# Altium schematic sheet APP_1_Power.SchDoc
size Tabloid; SheetNumber: 11; SheetTotal: 13; Sheet_Name: Power; Size: 11x17
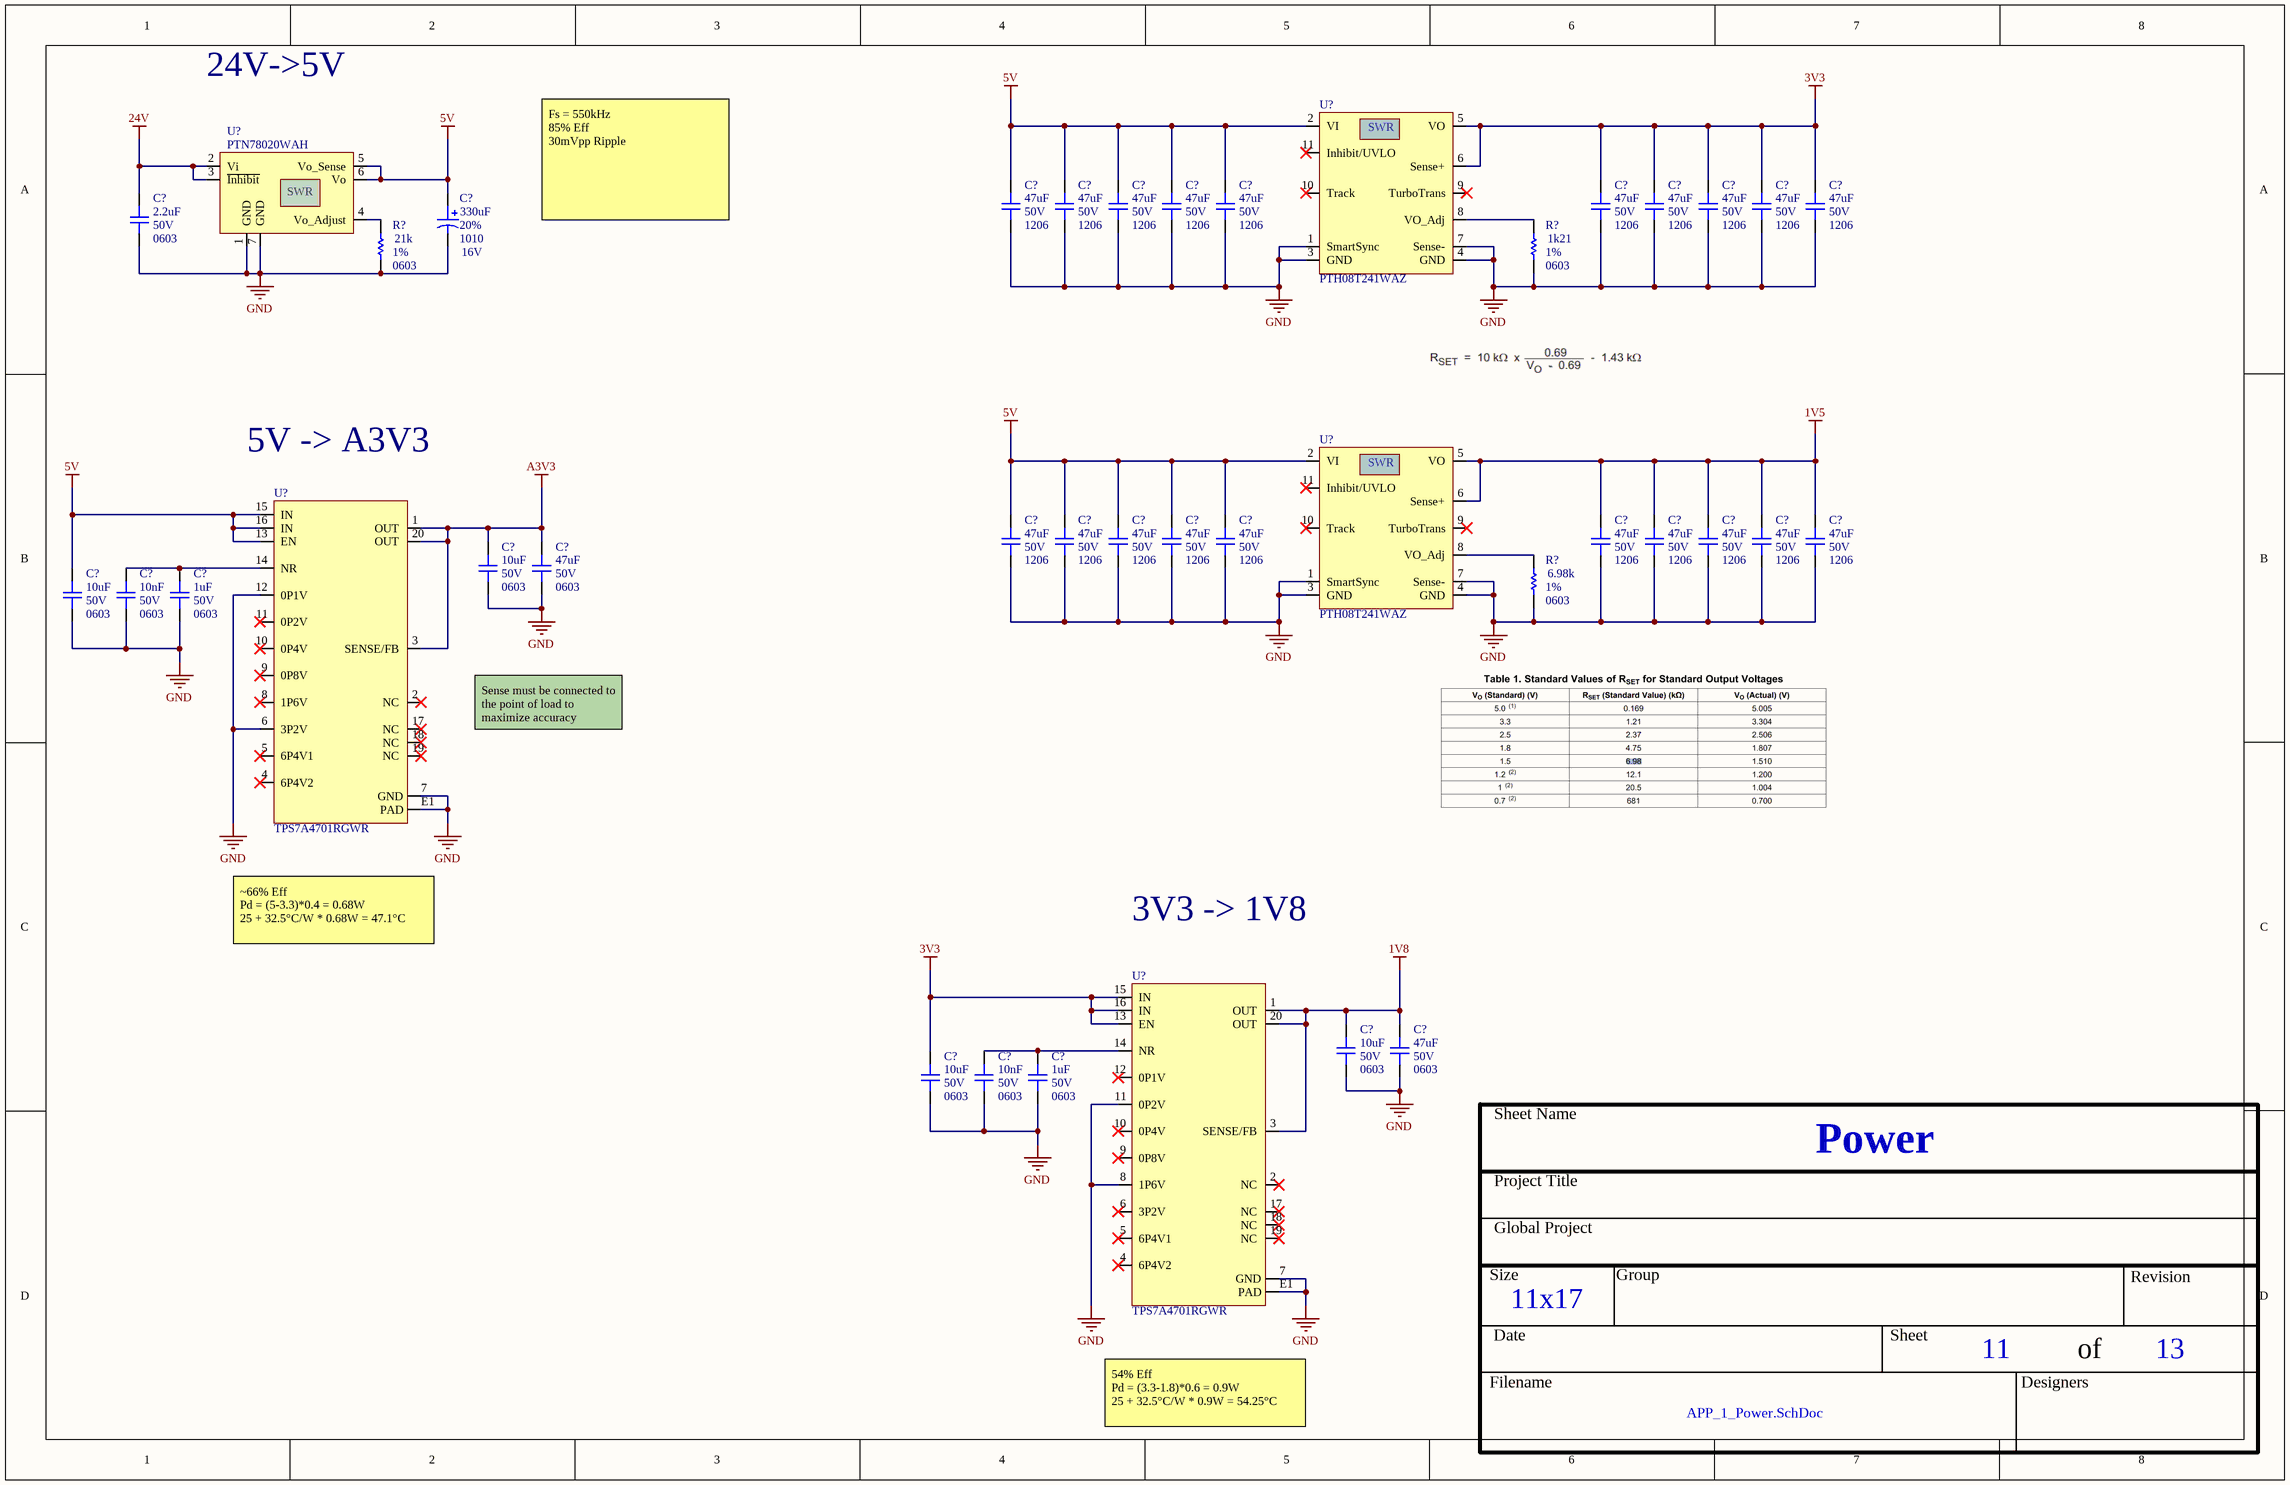
[diagram p0: APP_1_Power.SchDoc]

## Parts
(Parts that share a designator on the sheet are numbered #1, #2 ... from top to bottom, then left to right.)
C?#1  value 47uF  Voltage: 50V  Package: 1206  [CAP_1206]  (hidden comment: CAP - 1206)
C?#2  value 47uF  Voltage: 50V  Package: 1206  [CAP_1206]  (hidden comment: CAP - 1206)
C?#3  value 47uF  Voltage: 50V  Package: 1206  [CAP_1206]  (hidden comment: CAP - 1206)
C?#4  value 47uF  Voltage: 50V  Package: 1206  [CAP_1206]  (hidden comment: CAP - 1206)
C?#5  value 47uF  Voltage: 50V  Package: 1206  [CAP_1206]  (hidden comment: CAP - 1206)
C?#6  value 47uF  Voltage: 50V  Package: 1206  [CAP_1206]  (hidden comment: CAP - 1206)
C?#7  value 47uF  Voltage: 50V  Package: 1206  [CAP_1206]  (hidden comment: CAP - 1206)
C?#8  value 47uF  Voltage: 50V  Package: 1206  [CAP_1206]  (hidden comment: CAP - 1206)
C?#9  value 47uF  Voltage: 50V  Package: 1206  [CAP_1206]  (hidden comment: CAP - 1206)
C?#10  value 47uF  Voltage: 50V  Package: 1206  [CAP_1206]  (hidden comment: CAP - 1206)
C?#11  value 2.2uF  Voltage: 50V  Package: 0603  [CAP_0603]  (hidden comment: CAP - 0603)
C?#12  value 330uF  Voltage: 16V  Package: 1010  Precision: 20%  [CAP_ALU_1010_vishay]  (hidden comment: MAL214699501E3)
C?#13  value 47uF  Voltage: 50V  Package: 1206  [CAP_1206]  (hidden comment: CAP - 1206)
C?#14  value 47uF  Voltage: 50V  Package: 1206  [CAP_1206]  (hidden comment: CAP - 1206)
C?#15  value 47uF  Voltage: 50V  Package: 1206  [CAP_1206]  (hidden comment: CAP - 1206)
C?#16  value 47uF  Voltage: 50V  Package: 1206  [CAP_1206]  (hidden comment: CAP - 1206)
C?#17  value 47uF  Voltage: 50V  Package: 1206  [CAP_1206]  (hidden comment: CAP - 1206)
C?#18  value 47uF  Voltage: 50V  Package: 1206  [CAP_1206]  (hidden comment: CAP - 1206)
C?#19  value 47uF  Voltage: 50V  Package: 1206  [CAP_1206]  (hidden comment: CAP - 1206)
C?#20  value 47uF  Voltage: 50V  Package: 1206  [CAP_1206]  (hidden comment: CAP - 1206)
C?#21  value 47uF  Voltage: 50V  Package: 1206  [CAP_1206]  (hidden comment: CAP - 1206)
C?#22  value 47uF  Voltage: 50V  Package: 1206  [CAP_1206]  (hidden comment: CAP - 1206)
C?#23  value 10uF  Voltage: 50V  Package: 0603  [CAP_0603]  (hidden comment: CAP - 0603)
C?#24  value 47uF  Voltage: 50V  Package: 0603  [CAP_0603]  (hidden comment: CAP - 0603)
C?#25  value 10uF  Voltage: 50V  Package: 0603  [CAP_0603]  (hidden comment: CAP - 0603)
C?#26  value 10nF  Voltage: 50V  Package: 0603  [CAP_0603]  (hidden comment: CAP - 0603)
C?#27  value 1uF  Voltage: 50V  Package: 0603  [CAP_0603]  (hidden comment: CAP - 0603)
C?#28  value 10uF  Voltage: 50V  Package: 0603  [CAP_0603]  (hidden comment: CAP - 0603)
C?#29  value 47uF  Voltage: 50V  Package: 0603  [CAP_0603]  (hidden comment: CAP - 0603)
C?#30  value 10uF  Voltage: 50V  Package: 0603  [CAP_0603]  (hidden comment: CAP - 0603)
C?#31  value 10nF  Voltage: 50V  Package: 0603  [CAP_0603]  (hidden comment: CAP - 0603)
C?#32  value 1uF  Voltage: 50V  Package: 0603  [CAP_0603]  (hidden comment: CAP - 0603)
R?#1  value 21k  Package: 0603  Precision: 1%  [RES_0603]  (hidden comment: RES - 0603)
R?#2  value 1k21  Package: 0603  Precision: 1%  [RES_0603]  (hidden comment: RES - 0603)
R?#3  value 6.98k  Package: 0603  Precision: 1%  [RES_0603]  (hidden comment: RES - 0603)
U?#1  PTH08T241WAZ  [REG_SWR_PTH08T241WAZ]
U?#2  PTN78020WAH  [REG_SWR_PTN78020WAH]
U?#3  PTH08T241WAZ  [REG_SWR_PTH08T241WAZ]
U?#4  TPS7A4701RGWR  [REG_TPS7A4701RGWR]
U?#5  TPS7A4701RGWR  [REG_TPS7A4701RGWR]

## Nets
1V5: C?#18.2 C?#19.2 C?#20.2 C?#21.2 C?#22.2 U?#3.5(VO) U?#3.6(Sense+)
1V8: C?#28.2 C?#29.2 U?#5.1(OUT) U?#5.3(SENSE/FB) U?#5.20(OUT)
3V3: C?#6.2 C?#7.2 C?#8.2 C?#9.2 C?#10.2 C?#30.2 U?#1.5(VO) U?#1.6(Sense+) U?#5.13(EN) U?#5.15(IN) U?#5.16(IN)
5V: C?#1.2 C?#2.2 C?#3.2 C?#4.2 C?#5.2 C?#12.1 C?#13.2 C?#14.2 C?#15.2 C?#16.2 C?#17.2 C?#25.2 U?#1.2(VI) U?#2.5(Vo_Sense) U?#2.6(Vo) U?#3.2(VI) U?#4.13(EN) U?#4.15(IN) U?#4.16(IN)
24V: C?#11.2 U?#2.2(Vi) U?#2.3(~{Inhibit})
A3V3: C?#23.2 C?#24.2 U?#4.1(OUT) U?#4.3(SENSE/FB) U?#4.20(OUT)
GND: C?#1.1 C?#2.1 C?#3.1 C?#4.1 C?#5.1 C?#6.1 C?#7.1 C?#8.1 C?#9.1 C?#10.1 C?#11.1 C?#12.2 C?#13.1 C?#14.1 C?#15.1 C?#16.1 C?#17.1 C?#18.1 C?#19.1 C?#20.1 C?#21.1 C?#22.1 C?#23.1 C?#24.1 C?#25.1 C?#26.1 C?#27.1 C?#28.1 C?#29.1 C?#30.1 C?#31.1 C?#32.1 R?#1.1 R?#2.1 R?#3.1 U?#1.1(SmartSync) U?#1.3(GND) U?#1.4(GND) U?#1.7(Sense-) U?#2.1(GND) U?#2.7(GND) U?#3.1(SmartSync) U?#3.3(GND) U?#3.4(GND) U?#3.7(Sense-) U?#4.6(3P2V) U?#4.7(GND) U?#4.12(0P1V) U?#4.E1(PAD) U?#5.7(GND) U?#5.8(1P6V) U?#5.11(0P2V) U?#5.E1(PAD)
NetC?#26_2: C?#26.2 C?#27.2 U?#4.14(NR)
NetC?#31_2: C?#31.2 C?#32.2 U?#5.14(NR)
NetR?#1_2: R?#1.2 U?#2.4(Vo_Adjust)
NetR?#2_2: R?#2.2 U?#1.8(VO_Adj)
NetR?#3_2: R?#3.2 U?#3.8(VO_Adj)

Not connected (* = marked no-connect by the designer): U?#1 9(TurboTrans)* 10(Track)* 11(Inhibit/UVLO)*; U?#3 9(TurboTrans)* 10(Track)* 11(Inhibit/UVLO)*; U?#4 2(NC)* 4(6P4V2)* 5(6P4V1)* 8(1P6V)* 9(0P8V)* 10(0P4V)* 11(0P2V)* 17(NC)* 18(NC)* 19(NC)*; U?#5 2(NC)* 4(6P4V2)* 5(6P4V1)* 6(3P2V)* 9(0P8V)* 10(0P4V)* 12(0P1V)* 17(NC)* 18(NC)* 19(NC)*

## Notes on the sheet
- 24V->5V
- Fs = 550kHz
  85% Eff
  30mVpp Ripple
- 5V -> A3V3
- Sense must be connected to the point of load to maximize accuracy
- ~66% Eff
  Pd = (5-3.3)*0.4 = 0.68W
  25 + 32.5°C/W * 0.68W = 47.1°C
- 3V3 -> 1V8
- 54% Eff
  Pd = (3.3-1.8)*0.6 = 0.9W
  25 + 32.5°C/W * 0.9W = 54.25°C
- Sheet Name
- Project Title
- Global Project
- Size
- Group
- Revision
- Date
- Sheet
- of
- Filename
- Designers
- (in symbol REG_SWR_PTH08T241WAZ) SWR
- (in symbol REG_SWR_PTN78020WAH) SWR

## Library data of the parts
C?#1-C?#10 C?#13-C?#22 = CAP - 1206: Precision: 10%; Current: *; CreatedBy: Jonathan Bouchard; Power: *
C?#11 C?#23-C?#32 = CAP - 0603: Precision: 10%; Current: *; CreatedBy: Jonathan Bouchard; Power: *
C?#12 = CAP_ALU_MAL214699501E3: CAP - ALU 330uF 20% 16V - 1010; Current: 750mA; Mfg: Vishay Dale; Mfg Part Number: MAL214699501E3; HelpURL: http://www.vishay.com/docs/28403/146cti.pdf; CreatedBy: Jonathan Bouchard; Temperature: -55°C to 125°C; Power: *; Supplier 1: Digikey; Supplier Part Number 1: 4405PHCT-ND
U?#1 U?#3 = REG_SWR_PTH08T241WAZ: REG - MODULE PIP 10A 14VIN - 11-SMD; Manufacturer #1: Texas Instruments; Current Rating: 10A (out); Voltage rating: 4.5-14V (Input), 0.69 - 5.5V (Out); Polarized: Yes; Magnetic Material: UNKNOWN; Manufacturer #2: *; Note: *; Power Max: *; Value: *; Part Number #1: PTH08T241WAZ; Part Number #2: *; HelpURL: http://www.ti.com/lit/ds/symlink/pth08t241w.pdf; Supplier 1: Digi-Key; Supplier Part Number 1: 296-21339-ND; Assembly Type: SMD; Temperature: -40°C ~ 85°C; Package: SMD; CreatedBy/Date: Olivier Bernard / 6/5/2018; VerifiedBy: Caroline Paulin / 10 juillet 2018; Cryo: UNKNOWN
U?#2 = REG_SWR_PTN78020WAH: REG - DC DC CONVERTER 2.5-12.6V 6A - TH; Manufacturer #1: Texas Instruments; Value: 7V ~ 36V -> 2.5 ~ 12.6V; Voltage Rating: 36V; Power Max: 90 W; GRAMS Lib Spec: 2.8; Magnetic Material: Yes; Cryo: UNKNOWN; Tolerance: -; Current Rating: 6A; HelpURL: http://www.ti.com/lit/ds/symlink/ptn78020h.pdf; CreatedBy/Date: Arnaud_Samson_2019-07-09; VerifiedBy: c.Paulin - 15 juillet 2019; Temperature: -40°C ~ 85°C; Package: TH; Manufacturer #2: -; Assembly Type: TH; Part Number #2: -; Part Number #1: PTN78020WAH; Polarized: Yes; Supplier 1: Digi-Key; Supplier Part Number 1: 296-20515-ND
U?#4 U?#5 = REG_LDO_TPS7A4701RGWR: REG - LINEAR POS ADJ 1A - 20VQFN; Manufacturer #1: Texas Instruments; GRAMS Lib Spec: 2.8; Magnetic Material: Unknown; Polarized: Yes; Value: 1.4 à 34V; Voltage rating: 35V max; Assembly Type: SMD; CreatedBy/Date: L-P Gauthier / 2018-05-29; Current Rating: 1A; Manufacturer #2: TBD; Part Number #1: TPS7A4701RGWR; Part Number #2: TBD; Package: 20-VQFN Exposed Pad; Power Max: *; Tolerance: -; Supplier 1: Digi-Key; Supplier Part Number 1: 296-37224-1-ND; VerifiedBy: Caroline Paulin - 28 sept 2018; Temperature: -40°C ~ 125°C; HelpURL: http://www.ti.com/lit/ds/symlink/tps7a47.pdf; Cryo: UNKNOWN
R?#1-R?#3 = RES - 0603: Current: *; CreatedBy: Jonathan Bouchard